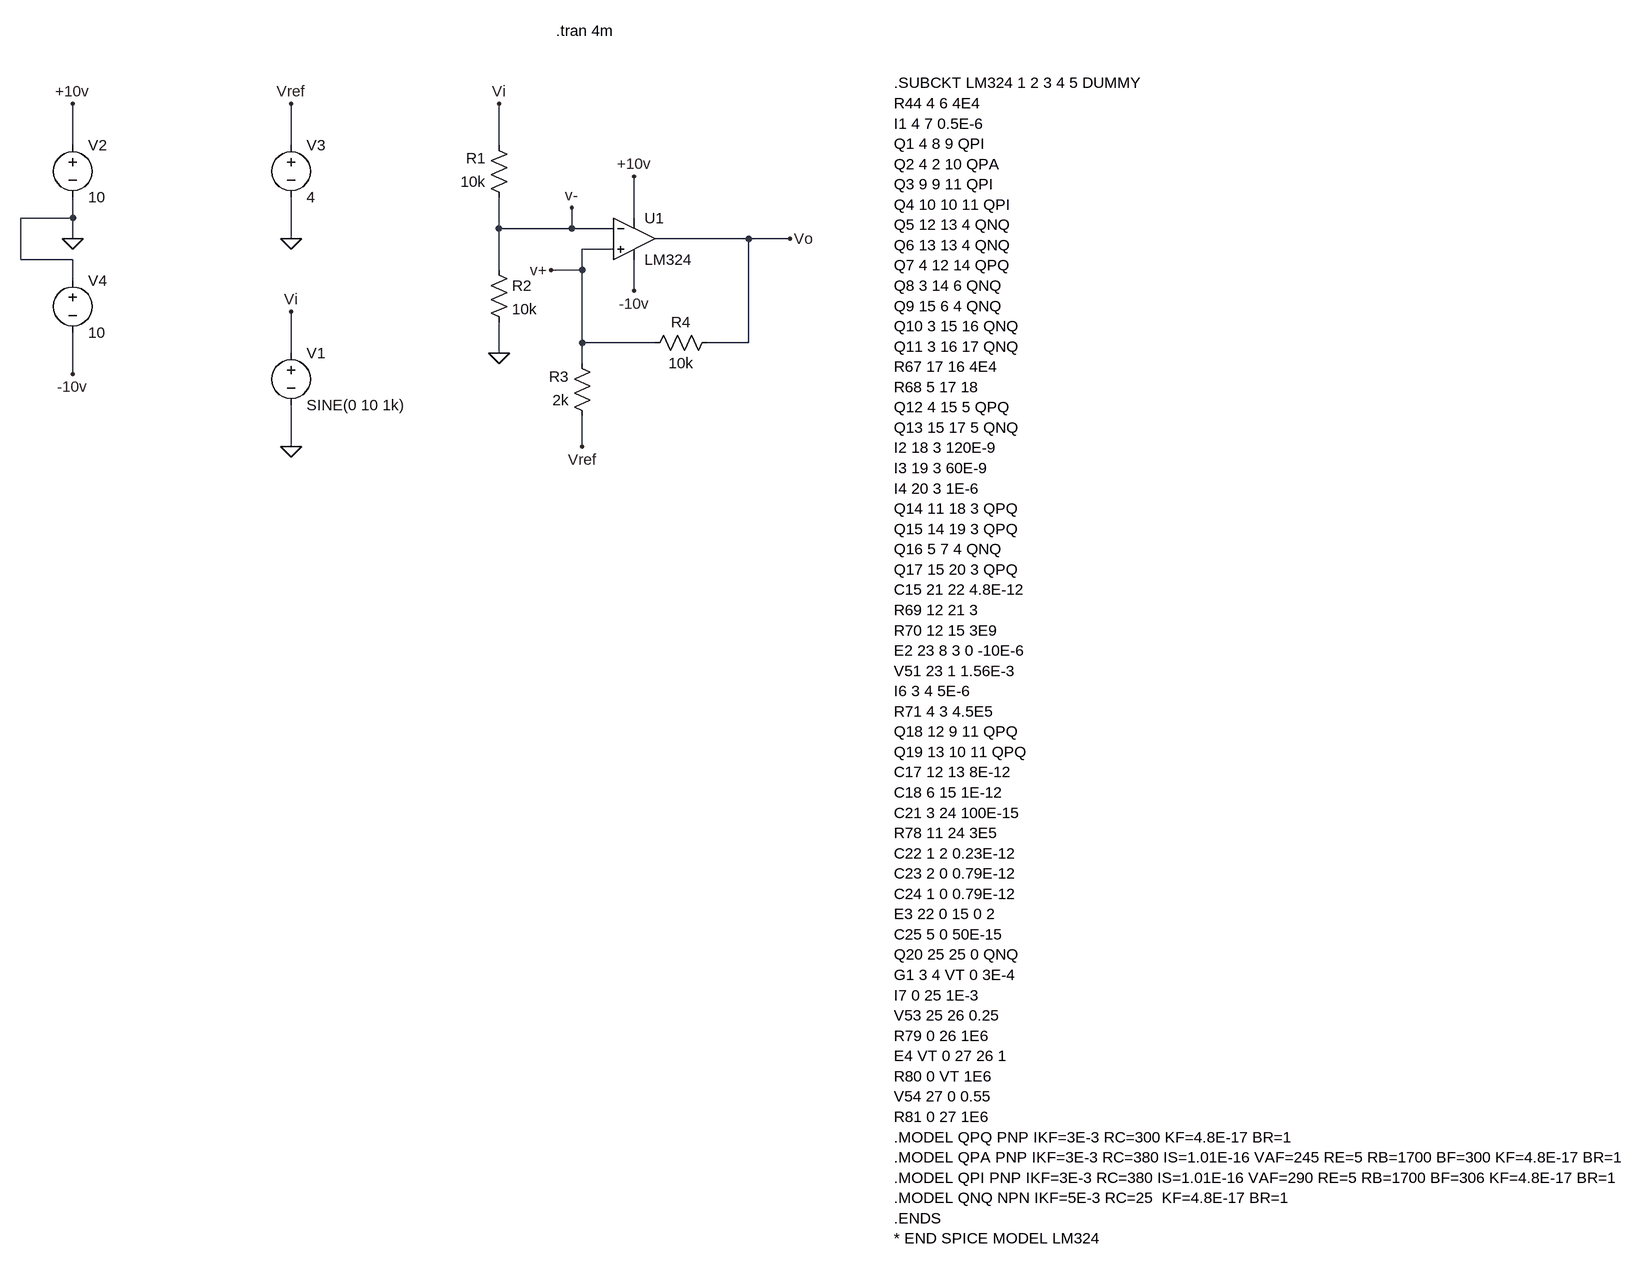
[diagram p0: schematic Laboratorio n° 1 - Circuito 4.asc]
Laboratorio n° 1 - Circuito 4.asc, the LTspice schematic file:
Version 4
SHEET 1 1724 1500
WIRE -736 -16 -736 -80
WIRE -400 -16 -400 -80
WIRE -80 -16 -80 -80
WIRE -736 96 -736 64
WIRE -736 96 -816 96
WIRE 128 96 128 32
WIRE -80 112 -80 64
WIRE 32 112 32 80
WIRE 32 112 -80 112
WIRE 96 112 32 112
WIRE -736 128 -736 96
WIRE -400 128 -400 64
WIRE 304 128 160 128
WIRE 368 128 304 128
WIRE 96 144 48 144
WIRE -816 160 -816 96
WIRE -736 160 -816 160
WIRE -80 176 -80 112
WIRE 48 176 48 144
WIRE 48 176 0 176
WIRE -736 192 -736 160
WIRE 128 208 128 160
WIRE 48 288 48 176
WIRE 160 288 48 288
WIRE 304 288 304 128
WIRE 304 288 240 288
WIRE -400 304 -400 240
WIRE -80 304 -80 256
WIRE 48 320 48 288
WIRE -736 336 -736 272
WIRE -400 448 -400 384
WIRE 48 448 48 400
FLAG -80 304 0
FLAG -80 -80 Vi
FLAG 128 32 +10v
FLAG 48 448 Vref
FLAG 368 128 Vo
FLAG -400 448 0
FLAG -400 240 Vi
FLAG -736 -80 +10v
FLAG -400 128 0
FLAG -400 -80 Vref
FLAG -736 336 -10v
FLAG -736 128 0
FLAG 32 80 v-
FLAG 0 176 v+
FLAG 128 208 -10v
SYMBOL OpAmps\\UniversalOpAmp 128 128 R0
SYMATTR InstName U1
SYMATTR Value LM324
SYMBOL res -64 80 R180
WINDOW 0 36 76 Left 2
WINDOW 3 36 40 Left 2
SYMATTR InstName R1
SYMATTR Value 10k
SYMBOL res -96 160 R0
SYMATTR InstName R2
SYMATTR Value 10k
SYMBOL res 64 416 R180
WINDOW 0 36 76 Left 2
WINDOW 3 36 40 Left 2
SYMATTR InstName R3
SYMATTR Value 2k
SYMBOL res 144 304 R270
WINDOW 0 32 56 VTop 2
WINDOW 3 0 56 VBottom 2
SYMATTR InstName R4
SYMATTR Value 10k
SYMBOL voltage -400 288 R0
WINDOW 123 0 0 Left 0
WINDOW 39 0 0 Left 0
SYMATTR InstName V1
SYMATTR Value SINE(0 10 1k)
SYMBOL voltage -736 -32 R0
WINDOW 123 0 0 Left 0
WINDOW 39 0 0 Left 0
SYMATTR InstName V2
SYMATTR Value 10
SYMBOL voltage -400 -32 R0
WINDOW 123 0 0 Left 0
WINDOW 39 0 0 Left 0
SYMATTR InstName V3
SYMATTR Value 4
SYMBOL voltage -736 176 R0
WINDOW 123 0 0 Left 0
WINDOW 39 0 0 Left 0
SYMATTR InstName V4
SYMATTR Value 10
TEXT 8 -192 Left 2 !.tran 4m
TEXT 528 -112 Left 2 !.SUBCKT LM324 1 2 3 4 5 DUMMY\nR44 4 6 4E4\nI1 4 7 0.5E-6\nQ1 4 8 9 QPI\nQ2 4 2 10 QPA\nQ3 9 9 11 QPI\nQ4 10 10 11 QPI\nQ5 12 13 4 QNQ\nQ6 13 13 4 QNQ\nQ7 4 12 14 QPQ\nQ8 3 14 6 QNQ\nQ9 15 6 4 QNQ\nQ10 3 15 16 QNQ\nQ11 3 16 17 QNQ\nR67 17 16 4E4\nR68 5 17 18\nQ12 4 15 5 QPQ\nQ13 15 17 5 QNQ\nI2 18 3 120E-9\nI3 19 3 60E-9\nI4 20 3 1E-6\nQ14 11 18 3 QPQ\nQ15 14 19 3 QPQ\nQ16 5 7 4 QNQ\nQ17 15 20 3 QPQ\nC15 21 22 4.8E-12\nR69 12 21 3\nR70 12 15 3E9\nE2 23 8 3 0 -10E-6\nV51 23 1 1.56E-3\nI6 3 4 5E-6\nR71 4 3 4.5E5\nQ18 12 9 11 QPQ\nQ19 13 10 11 QPQ\nC17 12 13 8E-12\nC18 6 15 1E-12\nC21 3 24 100E-15\nR78 11 24 3E5\nC22 1 2 0.23E-12\nC23 2 0 0.79E-12\nC24 1 0 0.79E-12\nE3 22 0 15 0 2\nC25 5 0 50E-15\nQ20 25 25 0 QNQ\nG1 3 4 VT 0 3E-4\nI7 0 25 1E-3\nV53 25 26 0.25\nR79 0 26 1E6\nE4 VT 0 27 26 1\nR80 0 VT 1E6\nV54 27 0 0.55\nR81 0 27 1E6\n.MODEL QPQ PNP IKF=3E-3 RC=300 KF=4.8E-17 BR=1\n.MODEL QPA PNP IKF=3E-3 RC=380 IS=1.01E-16 VAF=245 RE=5 RB=1700 BF=300 KF=4.8E-17 BR=1\n.MODEL QPI PNP IKF=3E-3 RC=380 IS=1.01E-16 VAF=290 RE=5 RB=1700 BF=306 KF=4.8E-17 BR=1\n.MODEL QNQ NPN IKF=5E-3 RC=25  KF=4.8E-17 BR=1\n.ENDS\n* END SPICE MODEL LM324

The netlist it stands for:
* Laboratorio n° 1 - Circuito 4.asc
XU1 v+ v- +10v -10v Vo level1 LM324 Avol=1Meg GBW=10Meg Vos=0 En=0 Enk=0 In=0 Ink=0 Rin=500Meg  ; pins In+ In- V+ V- OUT
R1 v- Vi 10k
R2 v- 0 10k
R3 Vref v+ 2k
R4 v+ Vo 10k
V1 Vi 0 SINE(0 10 1k)
V2 +10v 0 10
V3 Vref 0 4
V4 0 -10v 10
.tran 4m
.SUBCKT LM324 1 2 3 4 5 DUMMY
R44 4 6 4E4
I1 4 7 0.5E-6
Q1 4 8 9 QPI
Q2 4 2 10 QPA
Q3 9 9 11 QPI
Q4 10 10 11 QPI
Q5 12 13 4 QNQ
Q6 13 13 4 QNQ
Q7 4 12 14 QPQ
Q8 3 14 6 QNQ
Q9 15 6 4 QNQ
Q10 3 15 16 QNQ
Q11 3 16 17 QNQ
R67 17 16 4E4
R68 5 17 18
Q12 4 15 5 QPQ
Q13 15 17 5 QNQ
I2 18 3 120E-9
I3 19 3 60E-9
I4 20 3 1E-6
Q14 11 18 3 QPQ
Q15 14 19 3 QPQ
Q16 5 7 4 QNQ
Q17 15 20 3 QPQ
C15 21 22 4.8E-12
R69 12 21 3
R70 12 15 3E9
E2 23 8 3 0 -10E-6
V51 23 1 1.56E-3
I6 3 4 5E-6
R71 4 3 4.5E5
Q18 12 9 11 QPQ
Q19 13 10 11 QPQ
C17 12 13 8E-12
C18 6 15 1E-12
C21 3 24 100E-15
R78 11 24 3E5
C22 1 2 0.23E-12
C23 2 0 0.79E-12
C24 1 0 0.79E-12
E3 22 0 15 0 2
C25 5 0 50E-15
Q20 25 25 0 QNQ
G1 3 4 VT 0 3E-4
I7 0 25 1E-3
V53 25 26 0.25
R79 0 26 1E6
E4 VT 0 27 26 1
R80 0 VT 1E6
V54 27 0 0.55
R81 0 27 1E6
.MODEL QPQ PNP IKF=3E-3 RC=300 KF=4.8E-17 BR=1
.MODEL QPA PNP IKF=3E-3 RC=380 IS=1.01E-16 VAF=245 RE=5 RB=1700 BF=300 KF=4.8E-17 BR=1
.MODEL QPI PNP IKF=3E-3 RC=380 IS=1.01E-16 VAF=290 RE=5 RB=1700 BF=306 KF=4.8E-17 BR=1
.MODEL QNQ NPN IKF=5E-3 RC=25  KF=4.8E-17 BR=1
.ENDS
* END SPICE MODEL LM324
.lib UniversalOpAmp1.lib
.backanno
.end

* Results of the author's LTspice run, read from the files saved beside the schematic
* Operating Point, zero values left out:
*   V(-10v) = -10 V
*   V(v-) = 96.52 µV
*   V(+10v) = 10 V
*   V(vo) = 8.542 V
*   V(v+) = 4.757 V
*   V(vref) = 4 V
*   I(R1) = 9.652 nA
*   I(R2) = 9.652 nA
*   I(R3) = -378.5 µA
*   I(R4) = -378.5 µA
*   I(V1) = 9.652 nA
*   I(V2) = -503.2 µA
*   I(V3) = 378.5 µA
*   I(V4) = -124.7 µA
*   Ix(u1:1) = 18.52 pA
*   Ix(u1:2) = -19.3 nA
*   Ix(u1:3) = 503.2 µA
*   Ix(u1:4) = -124.7 µA
*   Ix(u1:5) = -378.5 µA
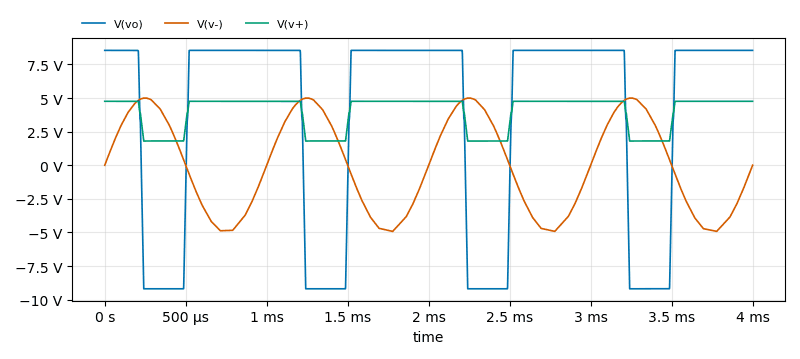
[diagram p1: Transient Analysis of Laboratorio n° 1 - Circuito 4.asc, plotted from the saved traces]
* Transient Analysis, 1 run:
*   V(vo): min -9.188 V, max 8.542 V, average 3.609 V, rms 8.528 V, last 8.542 V
*   V(v-): min -4.922 V, max 4.992 V, average 15.72 mV, rms 3.514 V, last -74.67 µV
*   V(v+): min 1.802 V, max 4.757 V, average 3.935 V, rms 4.14 V, last 4.757 V